# EAGLE schematic 7_7_9_usb_fpga (EAGLE 5.06)
DIGIKEY: CTX283LVCT-ND

## Sheet 1 of 2
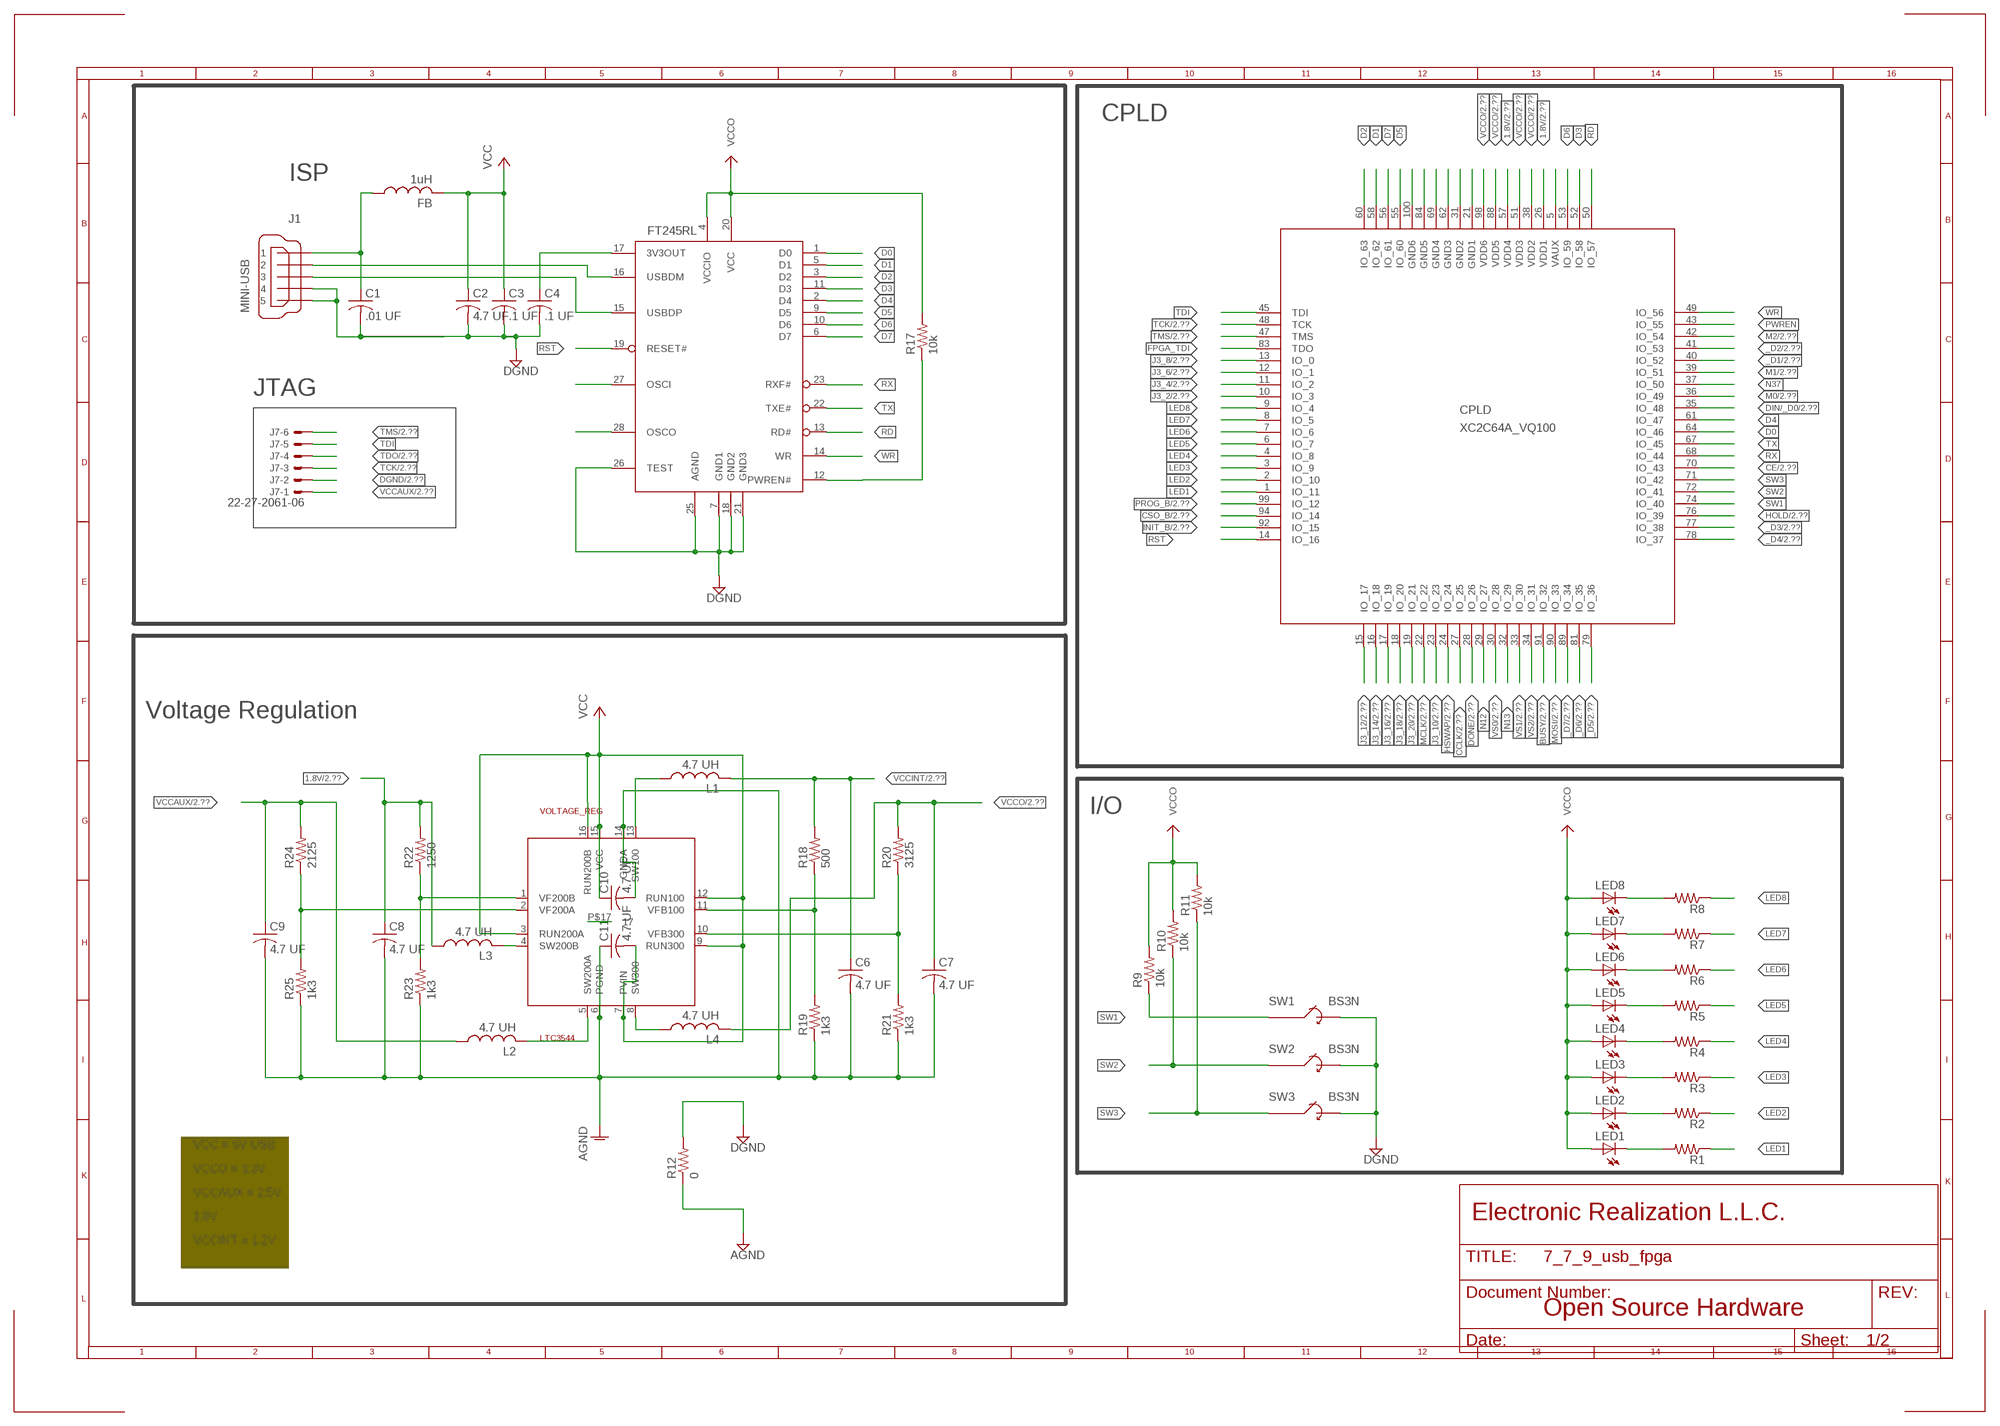
[diagram p0: schematic, sheet 1]

### Parts
C1  .01 UF  C-USC0603  [C0603]
C2  4.7 UF  C-USC0603  [C0603]
C3  .1 UF  C-USC0603  [C0603]
C4  .1 UF  C-USC0603  [C0603]
C6  4.7 UF  C-USC0603  [C0603]
C7  4.7 UF  C-USC0603  [C0603]
C8  4.7 UF  C-USC0603  [C0603]
C9  4.7 UF  C-USC0603  [C0603]
C10  4.7 UF  C-USC0603  [C0603]
C11  4.7 UF  C-USC0603  [C0603]
CPLD  XC2C64A_VQ100  [VQ100]
FB  1uH  FB  [R0805]
FT245RL  FT245RL  [SSOP28DB]
J1  MINI-USB  MINI-USB-SHIELD-UX60-MB-5ST  [UX60-MB-5ST]
J7  22-27-2061-06  [6410-06]
L1  4.7 UH  TDK3010  [L3010]
L2  4.7 UH  TDK3010  [L3010]
L3  4.7 UH  TDK3010  [L3010]
L4  4.7 UH  TDK3010  [L3010]
LED1  LEDCHIPLED_0603  [CHIPLED_0603]
LED2  LEDCHIPLED_0603  [CHIPLED_0603]
LED3  LEDCHIPLED_0603  [CHIPLED_0603]
LED4  LEDCHIPLED_0603  [CHIPLED_0603]
LED5  LEDCHIPLED_0603  [CHIPLED_0603]
LED6  LEDCHIPLED_0603  [CHIPLED_0603]
LED7  LEDCHIPLED_0603  [CHIPLED_0603]
LED8  LEDCHIPLED_0603  [CHIPLED_0603]
R1  R-US_R0603  [R0603]
R2  R-US_R0603  [R0603]
R3  R-US_R0603  [R0603]
R4  R-US_R0603  [R0603]
R5  R-US_R0603  [R0603]
R6  R-US_R0603  [R0603]
R7  R-US_R0603  [R0603]
R8  R-US_R0603  [R0603]
R9  10k  R-US_R0603  [R0603]
R10  10k  R-US_R0603  [R0603]
R11  10k  R-US_R0603  [R0603]
R12  0  R-US_R0603  [R0603]
R17  10k  R-US_R0603  [R0603]
R18  500  R-US_R0603  [R0603]
R19  1k3  R-US_R0603  [R0603]
R20  3125  R-US_R0603  [R0603]
R21  1k3  R-US_R0603  [R0603]
R22  1250  R-US_R0603  [R0603]
R23  1k3  R-US_R0603  [R0603]
R24  2125  R-US_R0603  [R0603]
R25  1k3  R-US_R0603  [R0603]
SW1  BS3N  [BS3N]
SW2  BS3N  [BS3N]
SW3  BS3N  [BS3N]
VOLTAGE_REG  LTC3544  [QFN16]

### Nets
1.8V: C8.1 CPLD.26(VDD1) CPLD.57(VDD4) L3.P$1 R22.2 ; also sheet 2
_D1: CPLD.40(IO_52) ; also sheet 2
_D2: CPLD.41(IO_53) ; also sheet 2
_D3: CPLD.77(IO_38) ; also sheet 2
_D4: CPLD.78(IO_37) ; also sheet 2
_D5: CPLD.79(IO_36) ; also sheet 2
_D6: CPLD.81(IO_35) ; also sheet 2
_D7: CPLD.89(IO_34) ; also sheet 2
AGND: C6.2 C7.2 C8.2 C9.2 C10.2 C11.1 R12.1 R19.1 R21.1 R23.1 R25.1 VOLTAGE_REG.6(PGND) VOLTAGE_REG.14(GNDA) VOLTAGE_REG.P$17
BUSY: CPLD.91(IO_32) ; also sheet 2
CCLK: CPLD.27(IO_25) ; also sheet 2
CE: CPLD.70(IO_43) ; also sheet 2
CSO_B: CPLD.94(IO_14) ; also sheet 2
D0: CPLD.64(IO_46) FT245RL.1(D0)
D1: CPLD.58(IO_62) FT245RL.5(D1)
D2: CPLD.60(IO_63) FT245RL.3(D2)
D3: CPLD.52(IO_58) FT245RL.11(D3)
D4: CPLD.61(IO_47) FT245RL.2(D4)
D5: CPLD.55(IO_60) FT245RL.9(D5)
D6: CPLD.53(IO_59) FT245RL.10(D6)
D7: CPLD.56(IO_61) FT245RL.6(D7)
DGND: C1.2 C2.2 C3.2 C4.2 CPLD.21(GND1) CPLD.31(GND2) CPLD.62(GND3) CPLD.69(GND4) CPLD.84(GND5) CPLD.100(GND6) FT245RL.7(GND1) FT245RL.18(GND2) FT245RL.21(GND3) FT245RL.25(AGND) FT245RL.26(TEST) J1.4 J1.5 J7.2 R12.2 SW1.2 SW2.2 SW3.2 ; also sheet 2
DIN/_D0: CPLD.35(IO_48) ; also sheet 2
DONE: CPLD.28(IO_26) ; also sheet 2
FPGA_TDI: CPLD.83(TDO) ; also sheet 2
HOLD: CPLD.76(IO_39) ; also sheet 2
HSWAP: CPLD.24(IO_24) ; also sheet 2
INIT_B: CPLD.92(IO_15) ; also sheet 2
J3_2: CPLD.10(IO_3) ; also sheet 2
J3_4: CPLD.11(IO_2) ; also sheet 2
J3_6: CPLD.12(IO_1) ; also sheet 2
J3_8: CPLD.13(IO_0) ; also sheet 2
J3_10: CPLD.23(IO_23) ; also sheet 2
J3_12: CPLD.15(IO_17) ; also sheet 2
J3_14: CPLD.16(IO_18) ; also sheet 2
J3_16: CPLD.17(IO_19) ; also sheet 2
J3_18: CPLD.18(IO_20) ; also sheet 2
J3_20: CPLD.19(IO_21) ; also sheet 2
LED1: CPLD.1(IO_11) R1.1
LED2: CPLD.2(IO_10) R2.1
LED3: CPLD.3(IO_9) R3.1
LED4: CPLD.4(IO_8) R4.1
LED5: CPLD.6(IO_7) R5.1
LED6: CPLD.7(IO_6) R6.1
LED7: CPLD.8(IO_5) R7.1
LED8: CPLD.9(IO_4) R8.1
M0: CPLD.36(IO_49) ; also sheet 2
M1: CPLD.39(IO_51) ; also sheet 2
M2: CPLD.42(IO_54) ; also sheet 2
MCLK: CPLD.22(IO_22) ; also sheet 2
MOSI: CPLD.90(IO_33) ; also sheet 2
N12: CPLD.29(IO_27)
N13: CPLD.32(IO_29)
N37: CPLD.37(IO_50)
N$2: R22.1 R23.2 VOLTAGE_REG.1(VF200B)
N$3: R24.1 R25.2 VOLTAGE_REG.2(VF200A)
N$4: R18.1 R19.2 VOLTAGE_REG.11(VFB100)
N$5: C1.1 FB.1 J1.1
N$6: R20.1 R21.2 VOLTAGE_REG.10(VFB300)
N$7: L1.P$1 VOLTAGE_REG.13(SW100)
N$13: L4.P$1 VOLTAGE_REG.8(SW300)
N$16: L2.P$2 VOLTAGE_REG.5(SW200A)
N$17: L3.P$2 VOLTAGE_REG.4(SW200B)
N$183: C4.1 FT245RL.17(3V3OUT)
N$187: FT245RL.27(OSCI)
N$188: FT245RL.28(OSCO)
N$196: LED1.C R1.2
N$197: LED2.C R2.2
N$198: LED3.C R3.2
N$199: LED4.C R4.2
N$200: LED5.C R5.2
N$201: LED6.C R6.2
N$202: LED7.C R7.2
N$203: LED8.C R8.2
PROG_B: CPLD.99(IO_12) ; also sheet 2
PWREN: CPLD.43(IO_55) FT245RL.12(PWREN#) R17.1
RD: CPLD.50(IO_57) FT245RL.13(RD#)
RST: CPLD.14(IO_16) FT245RL.19(RESET#)
RX: CPLD.68(IO_44) FT245RL.23(RXF#)
SW1: CPLD.74(IO_40) R9.1 SW1.1
SW2: CPLD.72(IO_41) R10.1 SW2.1
SW3: CPLD.71(IO_42) R11.1 SW3.1
TCK: CPLD.48(TCK) J7.3 ; also sheet 2
TDI: CPLD.45(TDI) J7.5
TDO: J7.4 ; also sheet 2
TMS: CPLD.47(TMS) J7.6 ; also sheet 2
TX: CPLD.67(IO_45) FT245RL.22(TXE#)
USBDM: FT245RL.16(USBDM) J1.2
USBDP: FT245RL.15(USBDP) J1.3
VCC: C2.1 C3.1 C10.1 C11.2 FB.2 VOLTAGE_REG.3(RUN200A) VOLTAGE_REG.7(PVIN) VOLTAGE_REG.9(RUN300) VOLTAGE_REG.12(RUN100) VOLTAGE_REG.15(VCC) VOLTAGE_REG.16(RUN200B) ; also sheet 2
VCCAUX: C9.1 CPLD.5(VAUX) J7.1 L2.P$1 R24.2 ; also sheet 2
VCCINT: C6.1 L1.P$2 R18.2 ; also sheet 2
VCCO: C7.1 CPLD.38(VDD2) CPLD.51(VDD3) CPLD.88(VDD5) CPLD.98(VDD6) FT245RL.4(VCCIO) FT245RL.20(VCC) L4.P$2 LED1.A LED2.A LED3.A LED4.A LED5.A LED6.A LED7.A LED8.A R9.2 R10.2 R11.2 R17.2 R20.2 ; also sheet 2
VS0: CPLD.30(IO_28) ; also sheet 2
VS1: CPLD.33(IO_30) ; also sheet 2
VS2: CPLD.34(IO_31) ; also sheet 2
WR: CPLD.49(IO_56) FT245RL.14(WR)
Unconnected: J1.M1(S1) J1.M2(S2) J1.M3(S3) J1.M4(S4)

### Notes on the sheet
- CPLD
- ISP
- JTAG
- Voltage Regulation
- I/O
- VCC = 5V USB
- VCCO = 3.3V
- VCCAUX = 2.5V
- 1.8V | Electronic Realization L.L.C.
- VCCINT = 1.2V
- Open Source Hardware

## Sheet 2 of 2
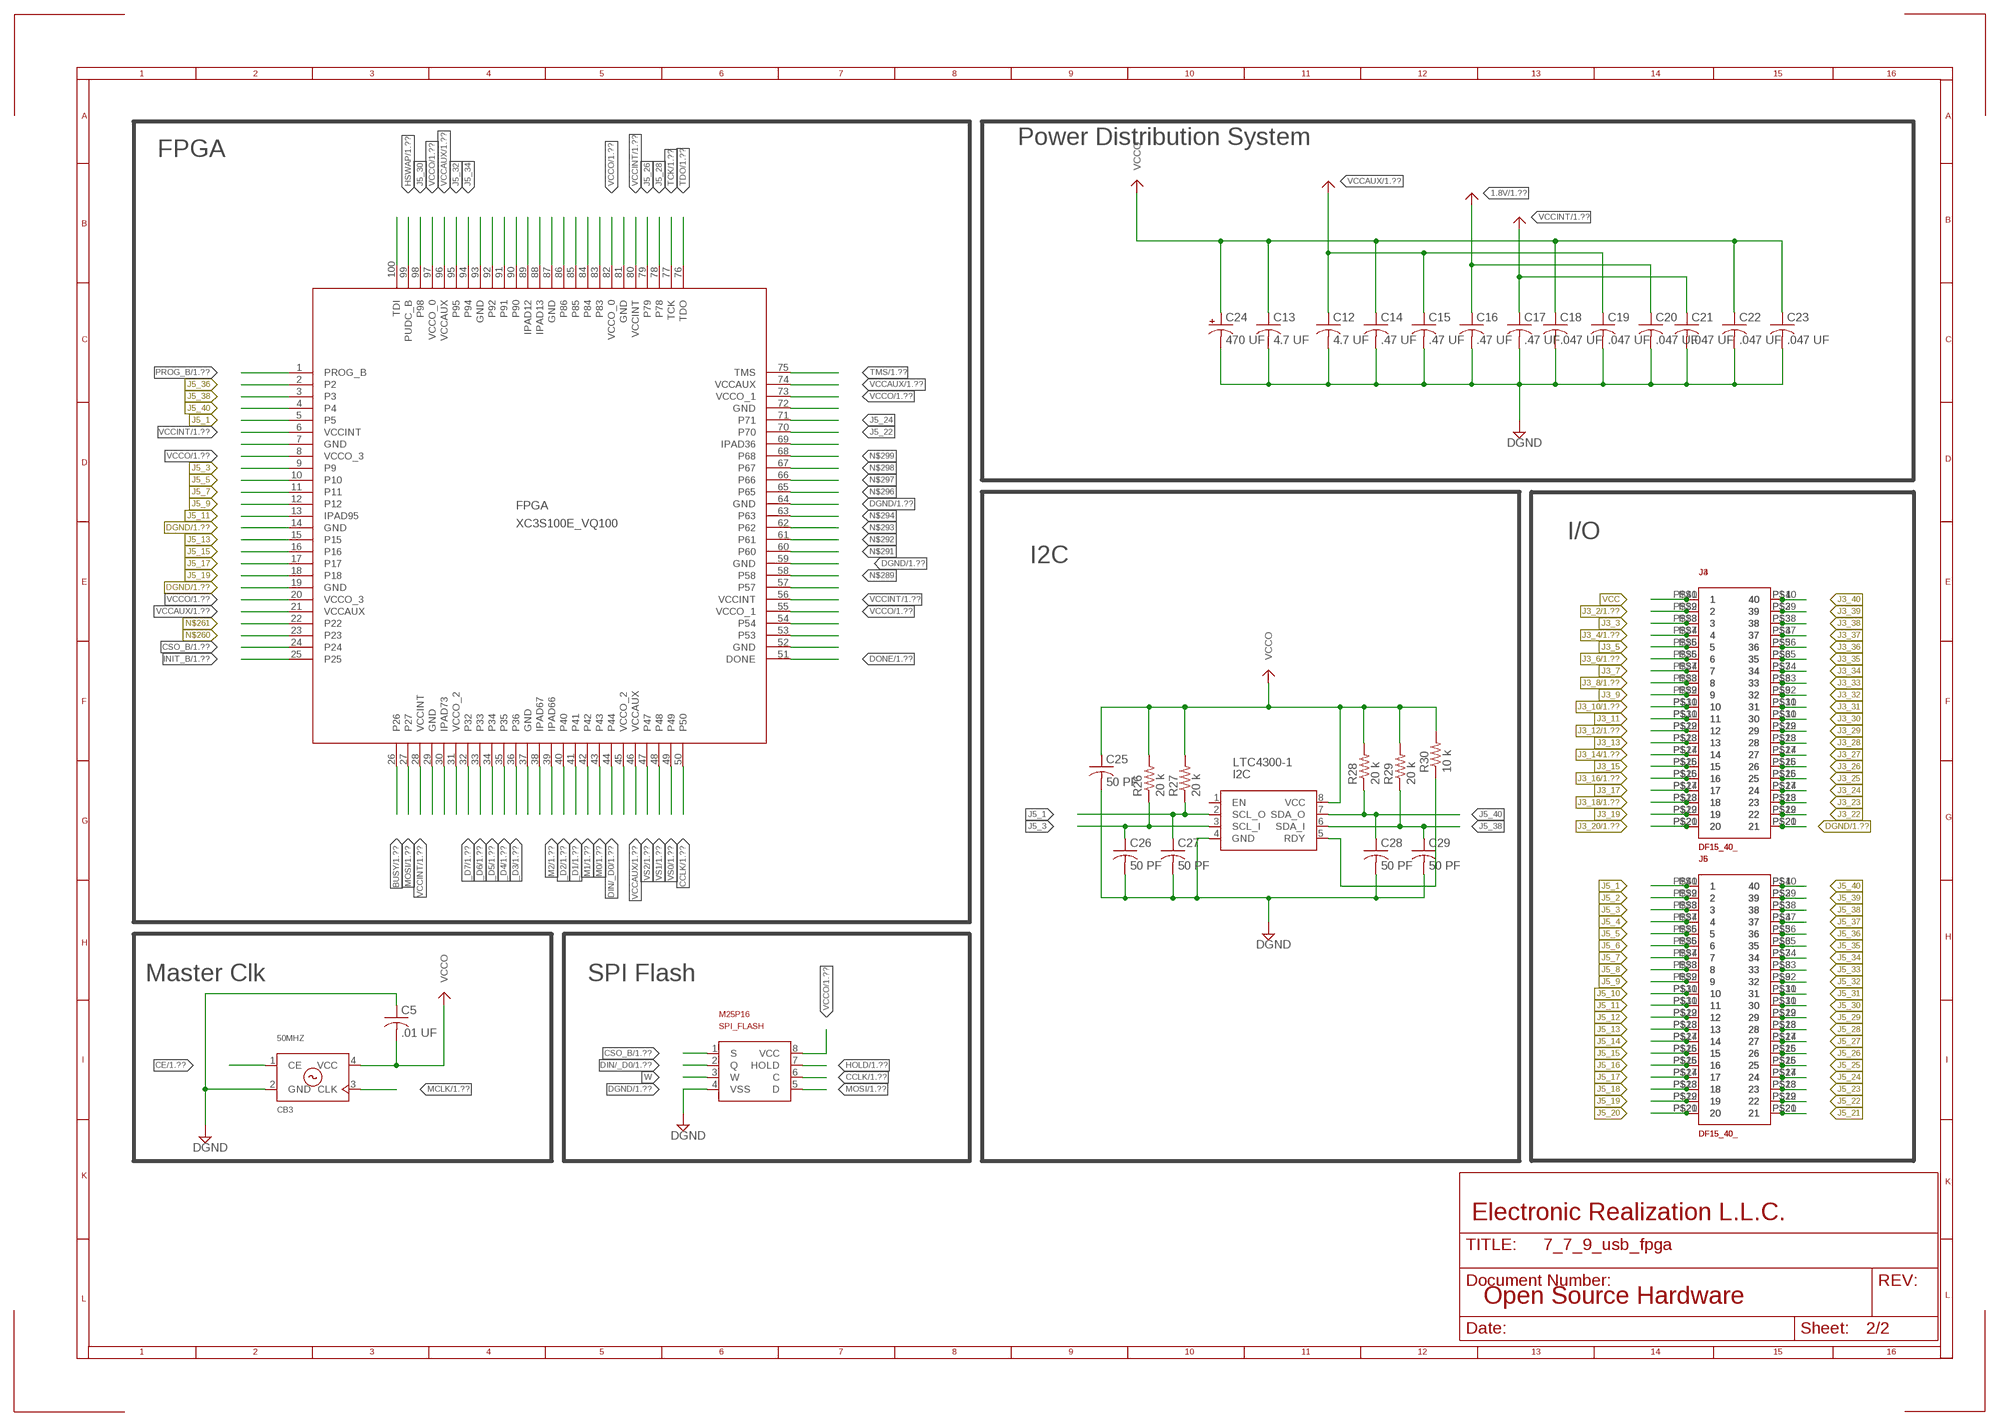
[diagram p1: schematic, sheet 2]

### Parts
50MHZ  CB3  [CB3]
C5  .01 UF  C-USC0603  [C0603]
C12  4.7 UF  C-USC0603  [C0603]
C13  4.7 UF  C-USC0603  [C0603]
C14  .47 UF  C-USC0603  [C0603]
C15  .47 UF  C-USC0603  [C0603]
C16  .47 UF  C-USC0603  [C0603]
C17  .47 UF  C-USC0603  [C0603]
C18  .047 UF  C-USC0603  [C0603]
C19  .047 UF  C-USC0603  [C0603]
C20  .047 UF  C-USC0603  [C0603]
C21  .047 UF  C-USC0603  [C0603]
C22  .047 UF  C-USC0603  [C0603]
C23  .047 UF  C-USC0603  [C0603]
C24  470 UF  CPOL-USCT7343  [CT7343]
C25  50 PF  C-USC0603  [C0603]
C26  50 PF  C-USC0603  [C0603]
C27  50 PF  C-USC0603  [C0603]
C28  50 PF  C-USC0603  [C0603]
C29  50 PF  C-USC0603  [C0603]
FPGA  XC3S100E_VQ100  [VQ100]
I2C  LTC4300-1  [MSOP8]
J3  DF15_40  [DF15]
J4  DF15_40_  [DF15_]
J5  DF15_40  [DF15]
J6  DF15_40_  [DF15_]
R26  20 k  R-US_R0603  [R0603]
R27  20 k  R-US_R0603  [R0603]
R28  20 k  R-US_R0603  [R0603]
R29  20 k  R-US_R0603  [R0603]
R30  10 k  R-US_R0603  [R0603]
SPI_FLASH  M25P16  [VDFPN8]

### Nets
1.8V: C16.1 C20.1 ; also sheet 1
_D1: FPGA.41 ; also sheet 1
_D2: FPGA.40 ; also sheet 1
_D3: FPGA.36 ; also sheet 1
_D4: FPGA.35 ; also sheet 1
_D5: FPGA.34 ; also sheet 1
_D6: FPGA.33 ; also sheet 1
_D7: FPGA.32 ; also sheet 1
BUSY: FPGA.26 ; also sheet 1
CCLK: FPGA.50 SPI_FLASH.6(C) ; also sheet 1
CE: 50MHZ.1(CE) ; also sheet 1
CSO_B: FPGA.24 SPI_FLASH.1(S) ; also sheet 1
DGND: 50MHZ.2(GND) C5.1 C12.2 C13.2 C14.2 C15.2 C16.2 C17.2 C18.2 C19.2 C20.2 C21.2 C22.2 C23.2 C24.- C25.2 C26.2 C27.2 C28.2 C29.2 FPGA.7(GND) FPGA.14(GND) FPGA.19(GND) FPGA.29(GND) FPGA.37(GND) FPGA.38(IPAD67) FPGA.52(GND) FPGA.59(GND) FPGA.64(GND) FPGA.72(GND) FPGA.81(GND) FPGA.87(GND) FPGA.93(GND) I2C.4(GND) J3.P$21 J4.P$20 SPI_FLASH.4(VSS) ; also sheet 1
DIN/_D0: FPGA.44 SPI_FLASH.2(Q) ; also sheet 1
DONE: FPGA.51(DONE) ; also sheet 1
FPGA_TDI: FPGA.100(TDI) ; also sheet 1
HOLD: SPI_FLASH.7(HOLD) ; also sheet 1
HSWAP: FPGA.99(PUDC_B) ; also sheet 1
INIT_B: FPGA.25 ; also sheet 1
J3_2: J3.P$2 J4.P$39 ; also sheet 1
J3_3: J3.P$3 J4.P$38
J3_4: J3.P$4 J4.P$37 ; also sheet 1
J3_5: J3.P$5 J4.P$36
J3_6: J3.P$6 J4.P$35 ; also sheet 1
J3_7: J3.P$7 J4.P$34
J3_8: J3.P$8 J4.P$33 ; also sheet 1
J3_9: J3.P$9 J4.P$32
J3_10: J3.P$10 J4.P$31 ; also sheet 1
J3_11: J3.P$11 J4.P$30
J3_12: J3.P$12 J4.P$29 ; also sheet 1
J3_13: J3.P$13 J4.P$28
J3_14: J3.P$14 J4.P$27 ; also sheet 1
J3_15: J3.P$15 J4.P$26
J3_16: J3.P$16 J4.P$25 ; also sheet 1
J3_17: J3.P$17 J4.P$24
J3_18: J3.P$18 J4.P$23 ; also sheet 1
J3_19: J3.P$19 J4.P$22
J3_20: J3.P$20 J4.P$21 ; also sheet 1
J3_22: J3.P$22 J4.P$19
J3_23: J3.P$23 J4.P$18
J3_24: J3.P$24 J4.P$17
J3_25: J3.P$25 J4.P$16
J3_26: FPGA.84 J3.P$26 J4.P$15
J3_27: J3.P$27 J4.P$14
J3_28: FPGA.85 J3.P$28 J4.P$13
J3_29: J3.P$29 J4.P$12
J3_30: FPGA.86 J3.P$30 J4.P$11
J3_31: J3.P$31 J4.P$10
J3_32: FPGA.88(IPAD13) J3.P$32 J4.P$9
J3_33: J3.P$33 J4.P$8
J3_34: FPGA.89(IPAD12) J3.P$34 J4.P$7
J3_35: J3.P$35 J4.P$6
J3_36: FPGA.90 J3.P$36 J4.P$5
J3_37: J3.P$37 J4.P$4
J3_38: FPGA.91 J3.P$38 J4.P$3
J3_39: J3.P$39 J4.P$2
J3_40: FPGA.92 J3.P$40 J4.P$1
J5_1: C27.1 FPGA.5 I2C.2(SCL_O) J5.P$1 J6.P$40 R27.1
J5_2: J5.P$2 J6.P$39
J5_3: C26.1 FPGA.9 I2C.3(SCL_I) J5.P$3 J6.P$38 R26.1
J5_4: J5.P$4 J6.P$37
J5_5: FPGA.10 J5.P$5 J6.P$36
J5_6: J5.P$6 J6.P$35
J5_7: FPGA.11 J5.P$7 J6.P$34
J5_8: J5.P$8 J6.P$33
J5_9: FPGA.12 J5.P$9 J6.P$32
J5_10: J5.P$10 J6.P$31
J5_11: FPGA.13(IPAD95) J5.P$11 J6.P$30
J5_12: J5.P$12 J6.P$29
J5_13: FPGA.15 J5.P$13 J6.P$28
J5_14: J5.P$14 J6.P$27
J5_15: FPGA.16 J5.P$15 J6.P$26
J5_16: J5.P$16 J6.P$25
J5_17: FPGA.17 J5.P$17 J6.P$24
J5_18: J5.P$18 J6.P$23
J5_19: FPGA.18 J5.P$19 J6.P$22
J5_20: J5.P$20 J6.P$21
J5_21: J5.P$21 J6.P$20
J5_22: FPGA.70 J5.P$22 J6.P$19
J5_23: J5.P$23 J6.P$18
J5_24: FPGA.71 J5.P$24 J6.P$17
J5_25: J5.P$25 J6.P$16
J5_26: FPGA.79 J5.P$26 J6.P$15
J5_27: J5.P$27 J6.P$14
J5_28: FPGA.78 J5.P$28 J6.P$13
J5_29: J5.P$29 J6.P$12
J5_30: FPGA.98 J5.P$30 J6.P$11
J5_31: J5.P$31 J6.P$10
J5_32: FPGA.95 J5.P$32 J6.P$9
J5_33: J5.P$33 J6.P$8
J5_34: FPGA.94 J5.P$34 J6.P$7
J5_35: J5.P$35 J6.P$6
J5_36: FPGA.2 J5.P$36 J6.P$5
J5_37: J5.P$37 J6.P$4
J5_38: C29.1 FPGA.3 I2C.6(SDA_I) J5.P$38 J6.P$3 R29.1
J5_39: J5.P$39 J6.P$2
J5_40: C28.1 FPGA.4 I2C.7(SDA_O) J5.P$40 J6.P$1 R28.1
M0: FPGA.43 ; also sheet 1
M1: FPGA.42 ; also sheet 1
M2: FPGA.39(IPAD66) ; also sheet 1
MCLK: 50MHZ.3(CLK) FPGA.83 ; also sheet 1
MOSI: FPGA.27 SPI_FLASH.5(D) ; also sheet 1
N$76: I2C.5(RDY) R30.1
N$224: FPGA.30(IPAD73)
N$260: FPGA.23
N$261: FPGA.22
N$284: FPGA.53
N$285: FPGA.54
N$288: FPGA.57
N$289: FPGA.58
N$291: FPGA.60
N$292: FPGA.61
N$293: FPGA.62
N$294: FPGA.63
N$296: FPGA.65
N$297: FPGA.66
N$298: FPGA.67
N$299: FPGA.68
N$300: FPGA.69(IPAD36)
PROG_B: FPGA.1(PROG_B) ; also sheet 1
TCK: FPGA.77(TCK) ; also sheet 1
TDO: FPGA.76(TDO) ; also sheet 1
TMS: FPGA.75(TMS) ; also sheet 1
VCC: J3.P$1 J4.P$40 ; also sheet 1
VCCAUX: C12.1 C15.1 C19.1 FPGA.21(VCCAUX) FPGA.46(VCCAUX) FPGA.74(VCCAUX) FPGA.96(VCCAUX) ; also sheet 1
VCCINT: C17.1 C21.1 FPGA.6(VCCINT) FPGA.28(VCCINT) FPGA.56(VCCINT) FPGA.80(VCCINT) ; also sheet 1
VCCO: 50MHZ.4(VCC) C5.2 C13.1 C14.1 C18.1 C22.1 C23.1 C24.+ C25.1 FPGA.8(VCCO_3) FPGA.20(VCCO_3) FPGA.31(VCCO_2) FPGA.45(VCCO_2) FPGA.55(VCCO_1) FPGA.73(VCCO_1) FPGA.82(VCCO_0) FPGA.97(VCCO_0) I2C.8(VCC) R26.2 R27.2 R28.2 R29.2 R30.2 SPI_FLASH.8(VCC) ; also sheet 1
VS0: FPGA.49 ; also sheet 1
VS1: FPGA.48 ; also sheet 1
VS2: FPGA.47 ; also sheet 1
W: SPI_FLASH.3(W)
Unconnected: I2C.1(EN)

### Notes on the sheet
- Power Distribution System
- FPGA
- I/O
- I2C
- Master Clk | SPI Flash
- Electronic Realization L.L.C.
- Open Source Hardware

## Library data of the parts
50MHZ = crystal:CB3
C1-C23 C25-C29 = rcl:C-US: CAPACITOR, American symbol
C24 = rcl:CPOL-US: POLARIZED CAPACITOR, American symbol
CPLD = xilinx:XC2C64A_VQ100: xc2c64a_vq100 edit this description Auto generated by make-symbol-device-package-bsdl.ulp Rev. 29 Source: xc2c64a_vq100.bsd
FB = rcl:FB
FPGA = xilinx:XC3S100E_VQ100: xc3s100e_vq100 edit this description Auto generated by make-symbol-device-package-bsdl.ulp Rev. 19 Source: xc3s100e_vq100.bsd
FT245RL = ftdichip-3:FT245RL: USB FIFO Controller 4th Generation USB Controller (USB <-> Parallel) - FIFO
I2C = linear-technology:LTC4300-1
J1 = con-hirose:MINI-USB-SHIELD-: MINI USB Connector Source: http://www.hirose.co.jp/cataloge_hp/e24000019.pdf
J3 J5 = con-hirose:DF15_40
J4 J6 = con-hirose:DF15_40_
J7 = con-molex:22-?-06: CONNECTOR wire to board 2.54 mm (.1 inch) pitch header
L1-L4 = rcl:TDK3010
LED1-LED8 = led:LED: LED OSRAM: - CHIPLED LG R971, LG N971, LY N971, LG Q971, LY Q971, LO R971, LY R971 LH N974, LH R974 LS Q976, LO Q976, LY Q976 LO Q996 - Hyper CHIPLED LW Q18S LB Q993, LB Q99A, LB R99A - SideLED LS A670, LO A670, LY A670, LG A670, LP A670 LB A673, LV A673, LT A673, LW A673 LH A674 LY A675 LS A676, LA A676, LO A676, LY A676, LW A676 LS A679, LY A679, LG A679 - Hyper Micro SIDELED® LS Y876, LA Y876, LO Y876, LY Y876 LT Y87S - SmartLED LW L88C, LW L88S LB L89C, LB L89S, LG L890 LS L89K, LO L89K, LY L89K LS L896, LA L896, LO L896, LY L896 - TOPLED LS T670, LO T670, LY T670, LG T670, LP T670 LSG T670, LSP T670, LSY T670, LOP T670, LYG T670 LG T671, LOG T671, LSG T671 LB T673, LV T673, LT T673, LW T673 LH T674 LS T676, LA T676, LO T676, LY T676, LB T676, LH T676, LSB T676, LW T676 LB T67C, LV T67C, LT T67C, LS T67K, LO T67K, LY T67K, LW E67C LS E67B, LA E67B, LO E67B, LY E67B, LB E67C, LV E67C, LT E67C LW T67C LS T679, LY T679, LG T679 LS T770, LO T770, LY T770, LG T770, LP T770 LB T773, LV T773, LT T773, LW T773 LH T774 LS E675, LA E675, LY E675, LS T675 LS T776, LA T776, LO T776, LY T776, LB T776 LHGB T686 LT T68C, LB T68C - Hyper Mini TOPLED® LB M676 - Mini TOPLED Santana® LG M470 LS M47K, LO M47K, LY M47K Source: http://www.osram.convergy.de LUXEON: - LUMILED® LXK2-PW12-R00, LXK2-PW12-S00, LXK2-PW14-U00, LXK2-PW14-V00 LXK2-PM12-R00, LXK2-PM12-S00, LXK2-PM14-U00 LXK2-PE12-Q00, LXK2-PE12-R00, LXK2-PE12-S00, LXK2-PE14-T00, LXK2-PE14-U00 LXK2-PB12-K00, LXK2-PB12-L00, LXK2-PB12-M00, LXK2-PB14-N00, LXK2-PB14-P00, LXK2-PB14-Q00 LXK2-PR12-L00, LXK2-PR12-M00, LXK2-PR14-Q00, LXK2-PR14-R00 LXK2-PD12-Q00, LXK2-PD12-R00, LXK2-PD12-S00 LXK2-PH12-R00, LXK2-PH12-S00 LXK2-PL12-P00, LXK2-PL12-Q00, LXK2-PL12-R00 Source: www.luxeon.com KINGBRIGHT: KA-3528ASYC Source: www.kingbright.com
R1-R12 R17-R30 = rcl:R-US_: RESISTOR, American symbol
SPI_FLASH = st-microelectronics:M25P16
SW1-SW3 = switch-omron:BS3N
VOLTAGE_REG = linear-technology:LTC3544